# Altium schematic sheet 51-2001-01-15_04 Power Module Schematic.SchDoc
size 431 x 279 mm; Organization: ORGANIZATION; Address1: ADDRESS 1; Address2: ADDRESS 2; Address3: ADDRESS 3; Address4: ADDRESS 4; Revision: -; SheetNumber: 4; SheetTotal: 4; ENG_APP_DATE: --/--/--; DSN_APP_DATE: --/--/--; CHK_APP_DATE: --/--/--
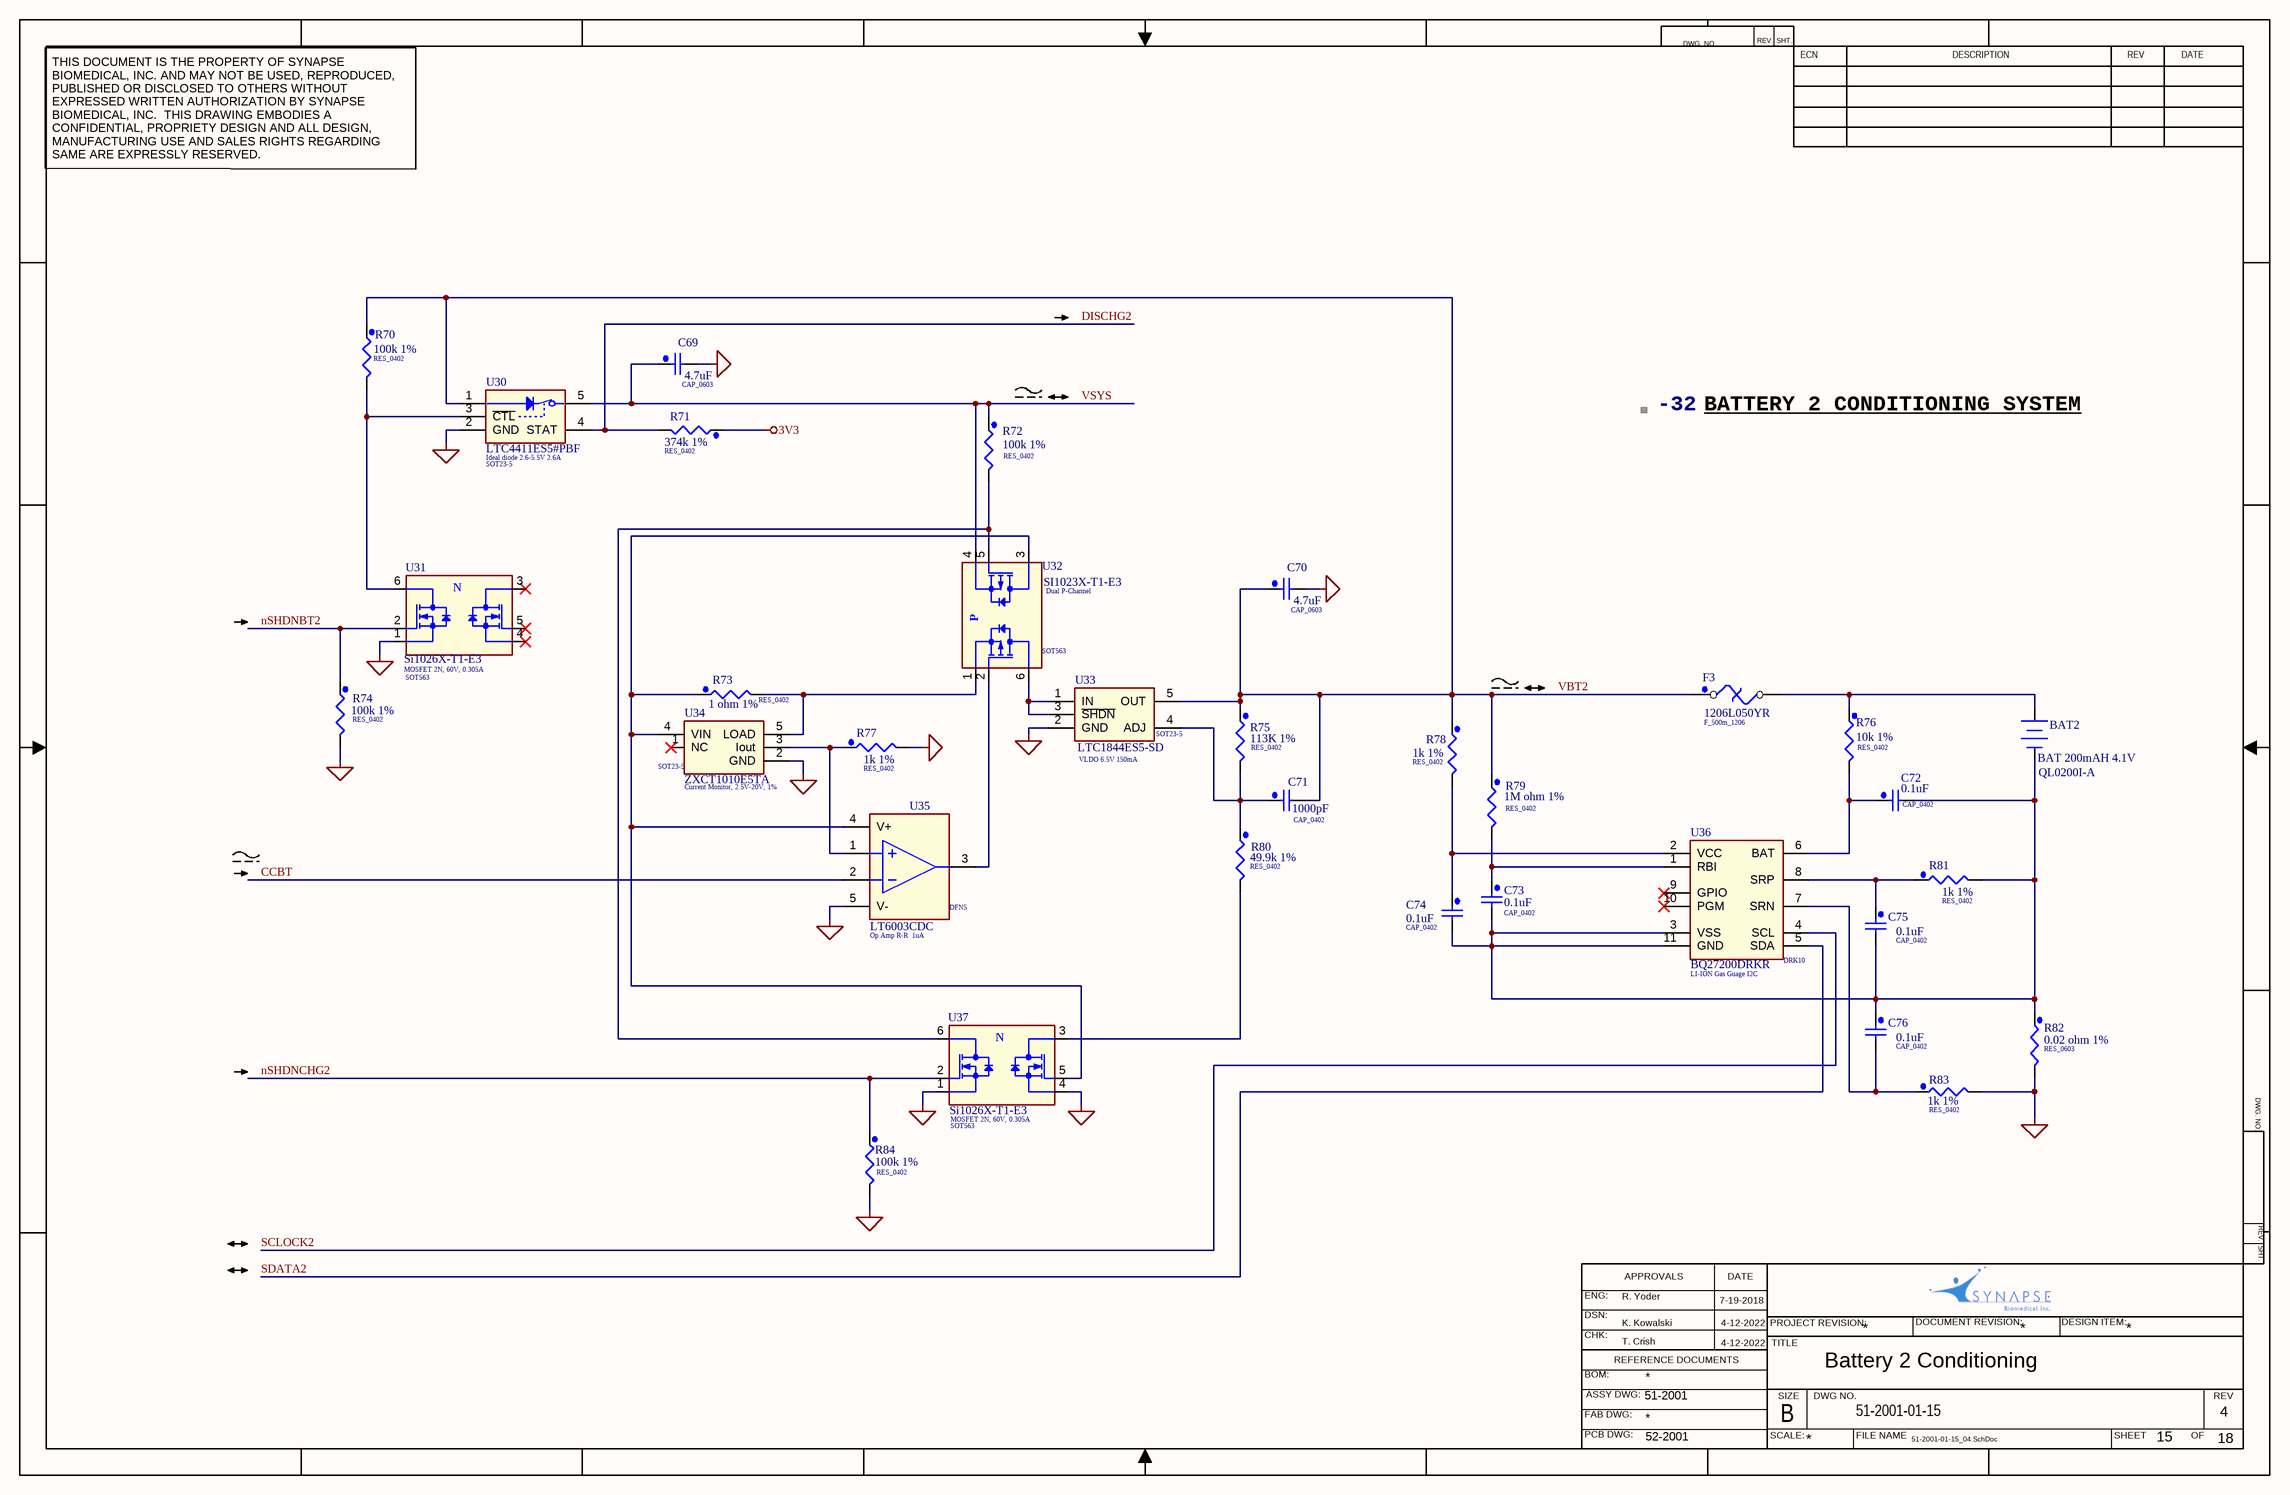
[diagram p0: 51-2001-01-15_04 Power Module Schematic.SchDoc]

## Parts
-32  XDESCRIPTION: BATTERY 2 CONDITIONING SYSTEM  (hidden comment: BOM_S1)  (graphical)
BAT2  BAT 200mAH 4.1V  [QL0200I-A]  (no BOM)
C69  value 4.7uF  [CAP_0603]  (hidden comment: C_4u7_X5R_10_0603_10%)
C70  value 4.7uF  [CAP_0603]  (hidden comment: C_4u7_X5R_10_0603_10%)
C71  value 1000pF  [CAP_0402]  (hidden comment: C_1n_C0G_50_0402_5%)
C72  value 0.1uF  [CAP_0402]  (hidden comment: C_100n_X7R_16_0402_10%)
C73  value 0.1uF  [CAP_0402]  (hidden comment: C_100n_X7R_16_0402_10%)
C74  value 0.1uF  [CAP_0402]  (hidden comment: C_100n_X7R_16_0402_10%)
C75  value 0.1uF  [CAP_0402]  (hidden comment: C_100n_X7R_16_0402_10%)
C76  value 0.1uF  [CAP_0402]  (hidden comment: C_100n_X7R_16_0402_10%)
F3  F_500m_1206  [FUSE_1206]
R70  value 100k 1%  [RES_0402]  (hidden comment: R_100k_0402)
R71  value 374k 1%  [RES_0402]  (hidden comment: R_374k_0402)
R72  value 100k 1%  [RES_0402]  (hidden comment: R_100k_0402)
R73  value 1 ohm 1%  [RES_0402]  (hidden comment: R_1_0402)
R74  value 100k 1%  [RES_0402]  (hidden comment: R_100k_0402)
R75  value 113K 1%  [RES_0402]  (hidden comment: R_113k_0402)
R76  value 10k 1%  [RES_0402]  (hidden comment: R_10k_0402)
R77  value 1k 1%  [RES_0402]  (hidden comment: R_1k_0402)
R78  value 1k 1%  [RES_0402]  (hidden comment: R_1k_0402)
R79  value 1M ohm 1%  [RES_0402]  (hidden comment: RES_0402)
R80  value 49.9k 1%  [RES_0402]  (hidden comment: R_49k9_0402)
R81  value 1k 1%  [RES_0402]  (hidden comment: R_1k_0402)
R82  value 0.02 ohm 1%  [RES_0603]  (hidden comment: R_20m_0603)
R83  value 1k 1%  [RES_0402]  (hidden comment: R_1k_0402)
R84  value 100k 1%  [RES_0402]  (hidden comment: R_100k_0402)
U30  Ideal diode 2.6-5.5V 2.6A  MPN: LTC4411ES5#PBF  [SOT23-5]
U31  MOSFET 2N, 60V, 0.305A  PackageDescription: SOT563  [SOT-563]
U32  Dual P-Channel  PackageDescription: SOT563  [SOT-563]
U33  VLDO 6.5V 150mA  [SOT23-5]
U34  Current Monitor, 2.5V-20V, 1%  [SOT23-5]
U35  Op Amp R-R  1uA  PackageDescription: DFN5  [DFN4]
U36  LI-ION Gas Guage I2C  PackageDescription: DRK10  [QFN10]
U37  MOSFET 2N, 60V, 0.305A  PackageDescription: SOT563  [SOT-563]

## Nets
3V3: R71.1
GND: C69.2 C70.2 R74.2 R77.2 R82.2 R83.2 U30.2(GND) U31.1(S1) U33.2(GND) U34.2(GND) U35.5(V-) U37.1(S1) U37.4(S2)
CCBT: U35.2(-IN)
DISCHG2: R71.2 U30.4(STAT)
nSHDNBT2: R74.1 U31.2(G1)
nSHDNCHG2: R84.1 U37.2(G1)
SCLOCK2: U36.4(SCL)
SDATA2: U36.5(SDA)
VBT2: C70.1 C71.2 F3.1 R70.1 R75.1 R78.1 R79.1 U30.1(IN) U33.5(OUT)
VSYS: C69.1 R72.1 U30.5(OUT) U32.4(S2)
NetBAT2_1: BAT2.1(+) F3.2 R76.1
NetBAT2_2: BAT2.2(-) C72.2 C73.2 C74.2 C75.2 C76.1 R81.2 R82.1 U36.3(VSS) U36.11(GND)
NetC71_1: C71.1 R75.2 R80.1 U33.4(ADJ)
NetC72_1: C72.1 R76.2 U36.6(BAT)
NetC73_1: C73.1 R79.2 U36.1(RBI)
NetC74_1: C74.1 R78.2 U36.2(VCC)
NetC75_1: C75.1 R81.1 U36.8(SRP)
NetC76_2: C76.2 R83.1 U36.7(SRN)
NetR70_2: R70.2 U30.3(~{CTL}) U31.6(D1)
NetR72_2: R72.2 U32.5(G2) U37.6(D1)
NetR73_1: R73.1 U32.3(D2) U34.4(VIN) U35.4(V+) U37.5(G2)
NetR73_2: R73.2 U32.1(S1) U34.5(LOAD)
NetR77_1: R77.1 U34.3(Iout) U35.1(+IN)
NetR80_2: R80.2 U37.3(D2)
NetU32_2: U32.2(G1) U35.3(OUT_A)
NetU32_6: U32.6(D1) U33.1(IN) U33.3(~{SHDN})

Not connected (* = marked no-connect by the designer): R84 2; U31 3(D2)* 4(S2)* 5(G2)*; U34 1(NC)*; U36 9(GPIO)* 10(PGM)*

## Notes on the sheet
- DWG. NO.
- REV.
- SHT.
- ECN
- DESCRIPTION
- REV
- DATE
- THIS DOCUMENT IS THE PROPERTY OF SYNAPSE BIOMEDICAL, INC. AND MAY NOT BE USED, REPRODUCED, PUBLISHED OR DISCLOSED TO OTHERS WITHOUT EXPRESSED WRITTEN AUTHORIZATION BY SYNAPSE BIOMEDICAL, INC.  THIS DRAWING EMBODIES A CONFIDENTIAL, PROPRIETY DESIGN AND ALL DESIGN, MANUFACTURING USE AND SALES RIGHTS REGARDING SAME ARE EXPRESSLY RESERVED.
- ENG:
- R. Yoder
- APPROVALS
- 7-19-2018
- DSN:
- CHK:
- REFERENCE DOCUMENTS
- K. Kowalski
- T. Crish
- 4-12-2022
- PROJECT REVISION:
- TITLE
- Battery 2 Conditioning
- *
- DOCUMENT REVISION:
- DESIGN ITEM:
- BOM:
- FAB DWG:
- PCB DWG:
- ASSY DWG:
- 51-2001
- SCALE:
- SIZE
- B
- DWG NO.
- 51-2001-01-15
- FILE NAME
- SHEET
- OF
- 4
- 52-2001
- 51-2001-01-15_04.SchDoc
- 15
- 18
- (in symbol SI1023X-T1-E3) P
- (in symbol Si1026X-T1-E3) N

## Library data of the parts
-32 = BOM_S1: BOM item small graphic
BAT2 = QL0200I-A: Li-ion battery 200mAH 4.1V; MFR: Quallion; Value: 200mAH 4.1V; Supplier 1: Quallion; Supplier Part Number 1: QL0200I-A; MPN: QL0200I-A
C69 C70 = LMK107BJ475KA-T: 4.7uF, 10V, X5R, 10%, 0603, RoHS; MFR: Murata Electronics North America; MPN: GRM185R61A475KE11D; SBI: 53-0076; PackageDescription: CAP_0603; Supplier 1: Digi-Key; Supplier Part Number 1: 490-11988-6-ND
C71 = GRM1555C1H102JA01D: 1000pF, 50V, C0G, 5%, 0402, RoHS; MFR: Murata; SBI: 53-0041-2; PackageDescription: CAP_0402; Supplier 1: Digi-Key; Supplier Part Number 1: 490-3244-1-ND; MPN: GRM1555C1H102JA01D
C72-C76 = GRM155R71C104KA88D: 0.1uF, 16V, X7R, 0402, RoHS; MFR: Murata; SBI: 53-0040-1; PackageDescription: CAP_0402; Supplier 1: Digi-Key; Supplier Part Number 1: 490-3261-2-ND; MPN: GRM155R71C104KA88D
F3 = 1206L050YR: PTC Resettable, 500mA, 0.4 ohm,  6V, 1206, RoHS; MFR: Littelfuse; SBI: 54-0113; PackageDescription: F_500m_1206; Supplier 1: Digi-Key; Supplier Part Number 1: F2112CT-ND; Value: 500mA; MPN: 1206L050YR
R70 R72 R74 R84 = MCR01MZPF1003: 100k ohm, 1%, 1/16W, smd, 0402, RoHS; MFR: Vishay Dale; MPN: CRCW0402100KFKED; SBI: 53-0049-7; PackageDescription: RES_0402; Supplier 1: Digi-Key; Supplier Part Number 1: 541-100KLDKR-ND
R71 = CRCW0402374KFKED: 374k ohm, 1%, 1/16W, 0402,RoHS; MFR: Vishay Dale; SBI: 53-0049-25; PackageDescription: RES_0402; Supplier 1: Digi-Key; Supplier Part Number 1: 541-374KLDKR-ND; MPN: CRCW0402374KFKED
R73 = CRCW04021R00FNED: 1.0 ohm, 1%, 1/16W, 0402, RoHS; MFR: Vishay; PackageDescription: RES_0402; Supplier 1: Digi-Key; Supplier Part Number 1: 541-1.00LCT-ND; MPN: CRCW04021R00FNED
R75 = ERJ-2RKF1133X: 113k ohm, 1%, 1/16W, 0402, RoHS; MFR: Vishay Dale; MPN: CRCW0402113KFKED; SBI: 53-0049-33; PackageDescription: RES_0402; Supplier 1: Digi-Key; Supplier Part Number 1: 541-113KLDKR-ND
R76 = MCR01MZPF1002: 10.0k ohm, 1%, 1/16W, smd, 0402, RoHS; MFR: Vishay Dale; MPN: CRCW040210K0FKED; PackageDescription: RES_0402; Supplier 1: Digi-Key; Supplier Part Number 1: 541-10.0KLDKR-ND
R77 R78 R81 R83 = MCR01MZPF1001: 1.0k ohm 1% 1/16W smd 0402 RoHS; MFR: Vishay Dale; MPN: CRCW04021K00FKED; SBI: 53-0049-4; PackageDescription: RES_0402; Supplier 1: Digi-Key; Supplier Part Number 1: 541-1.00KLDKR-ND
R79 = MCR01MZPF1004: 1M ohm, 1/16W, 1%, 0402, RoHS; MFR: Vishay Dale; MPN: CRCW04021M00FKED; SBI: 53-0095; PackageDescription: RES_0402; Supplier 1: Digi-Key; Supplier Part Number 1: 541-1.00MLDKR-ND
R80 = MCR01MZPF4992: 49.9k ohm, 1%, 1/16W, 0402, RoHS; MFR: Vishay Dale; MPN: CRCW040249K9FKED; SBI: 53-009-2; PackageDescription: RES_0402; Supplier 1: Digi-Key; Supplier Part Number 1: 541-49.9KLDKR-ND
R82 = WSL0603R0200FEA: 0.02 ohm, 1%, 1/10W, 0603, RoHS; MFR: Vishay Dale; SBI: 53-0087; PackageDescription: RES_0603; Supplier 1: Digi-Key; Supplier Part Number 1: WSLJ-.02DKR-ND; MPN: WSL0603R0200FEA
U30 = LTC4411ES5: Ideal diode, 2.6-5.5V, 2.6A, SOT23-5, RoHS; MFR: Linear Technology; SBI: 54-0101; Supplier 1: Digi-Key; Supplier Part Number 1: LTC4411ES5#TRMPBFDKR-ND; PackageDescription: SOT23-5
U31 U37 = Si1026X-T1-E3: MOSFET 2N, 60V, 0.305A, RoHS; MFR: Vishay Siliconix; Value: 500mA; SBI: 54-0102; Supplier 1: Digi-Key; Supplier Part Number 1: SI1026X-T1-E3CT-ND; MPN: Si1026X-T1-E3
U32 = SI1023X-T1-E3: Dual P-Channel Mosfet, SOT563, RoHS; MFR: Vishay Siliconix; Value: -350mA; SBI: 54-0103; Supplier 1: Digi-Key; Supplier Part Number 1: SI1023X-T1-GE3CT-ND; MPN: SI1023X-T1-E3
U33 = LTC1844ES5-SD: VLDO, 150mA, SOT23-5, RoHS; MFR: Linear Technology; SBI: 54-0104; Supplier 1: Digi-Key; Supplier Part Number 1: LTC1844ES5-SD#TRMPBFDKR-ND; PackageDescription: SOT23-5; Value: 150mA; MPN: LTC1844ES5-SD
U34 = ZXCT1010E5TA: Current Monitor, 2.5V-20V, 1%, RoHS; MFR: Diodes Incorporated; SBI: 54-0052; ComponentLink1URL: Q:\00\04\00-04-3500 Zetex ZXCT1010.pdf; ComponentNNPS_PN: 00-04-3500; PackageDescription: SOT23-5; Supplier 1: Digi-Key; Supplier Part Number 1: ZXCT1010DKR-ND; Value: ZXCT1010; MPN: ZXCT1010E5TA
U35 = LT6003CDC: Op Amp, R-R, 1uA, RoHS; MFR: Linear Technology; SBI: 54-0105; Supplier 1: Digi-Key; Supplier Part Number 1: LT6003CDC#TRMPBFDKR-ND; MPN: LT6003CDC
U36 = BQ27200DRKR: LI-ION Gas Guage, I2C, QFN10, RoHS; MFR: Texas Instruments; SBI: 54-0106; Supplier 1: Digi-Key; Supplier Part Number 1: 296-17521-6-ND; MPN: BQ27200DRKR